# EAGLE design sonars (EAGLE 6.4)
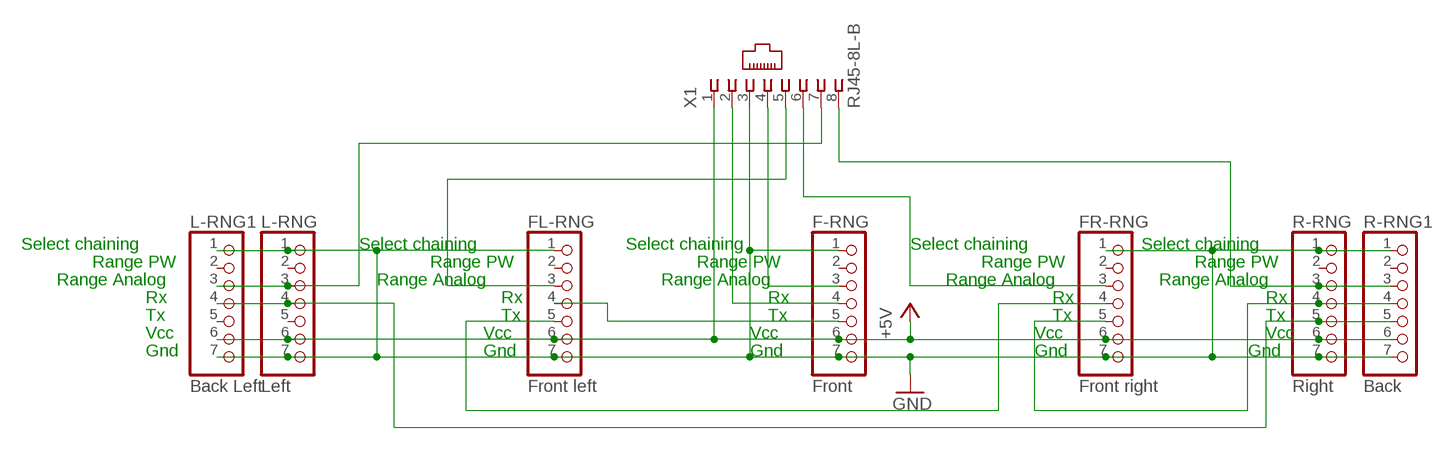
[diagram p0: schematic, sheet 1]

## Parts
F-RNG  Front  PINHD-1X7  [1X07]
FL-RNG  Front left  PINHD-1X7  [1X07]
FR-RNG  Front right  PINHD-1X7  [1X07]
L-RNG  Left  PINHD-1X7  [1X07]
L-RNG1  Back Left  PINHD-1X7  [1X07]
R-RNG  Right  PINHD-1X7  [1X07]
R-RNG1  Back  PINHD-1X7  [1X07]
X1  RJ45-8L-B  [RJ45-NO-SHIELD]

## Nets
+5V: F-RNG.6 FL-RNG.6 FR-RNG.6 L-RNG1.6 L-RNG.6 R-RNG1.6 R-RNG.6 X1.1
CHN: F-RNG.4 X1.2
F>FL: F-RNG.5 FL-RNG.4
F_RNG: F-RNG.3 X1.4
FL>FR: FL-RNG.5 FR-RNG.4
FL_RNG: FL-RNG.3 X1.5
FR>R: FR-RNG.5 R-RNG1.4 R-RNG.4
FR_RNG: FR-RNG.3 X1.6
GND: F-RNG.1 F-RNG.7 FL-RNG.1 FL-RNG.7 FR-RNG.1 FR-RNG.7 L-RNG1.1 L-RNG1.7 L-RNG.1 L-RNG.7 R-RNG1.1 R-RNG1.7 R-RNG.1 R-RNG.7 X1.3
L_RNG: L-RNG1.3 L-RNG.3 X1.7
R>L: L-RNG1.4 L-RNG.4 R-RNG1.5 R-RNG.5
R_RNG: R-RNG1.3 R-RNG.3 X1.8
Unconnected: F-RNG.2 FL-RNG.2 FR-RNG.2 L-RNG1.2 L-RNG1.5 L-RNG.2 L-RNG.5 R-RNG1.2 R-RNG.2

## Notes on the sheet
- Select chaining | Select chaining | Select chaining | Select chaining | Select chaining
- Range PW | Range PW | Range PW | Range PW | Range PW
- Range Analog | Range Analog | Range Analog | Range Analog | Range Analog
- Rx | Rx | Rx | Rx | Rx
- Tx | Tx | Tx | Tx | Tx
- Vcc | Vcc | Vcc | Vcc | Vcc
- Gnd | Gnd | Gnd | Gnd | Gnd

## Library data of the parts
F-RNG FL-RNG FR-RNG L-RNG L-RNG1 R-RNG R-RNG1 = pinhead:PINHD-1X7: PIN HEADER
X1 = con-tycoelectronics:RJ45: CORCOM Modular RJ Jacks No Shield Source: www.tycoelectronics.com .. ENG_DS_1654001_1099_RJ_L_0507.pdf; MF: TYCO ELECTRONICS; MPN: RJ45-8L-B; OC_FARNELL: 1279843; OC_NEWARK: 52K4445

## Board
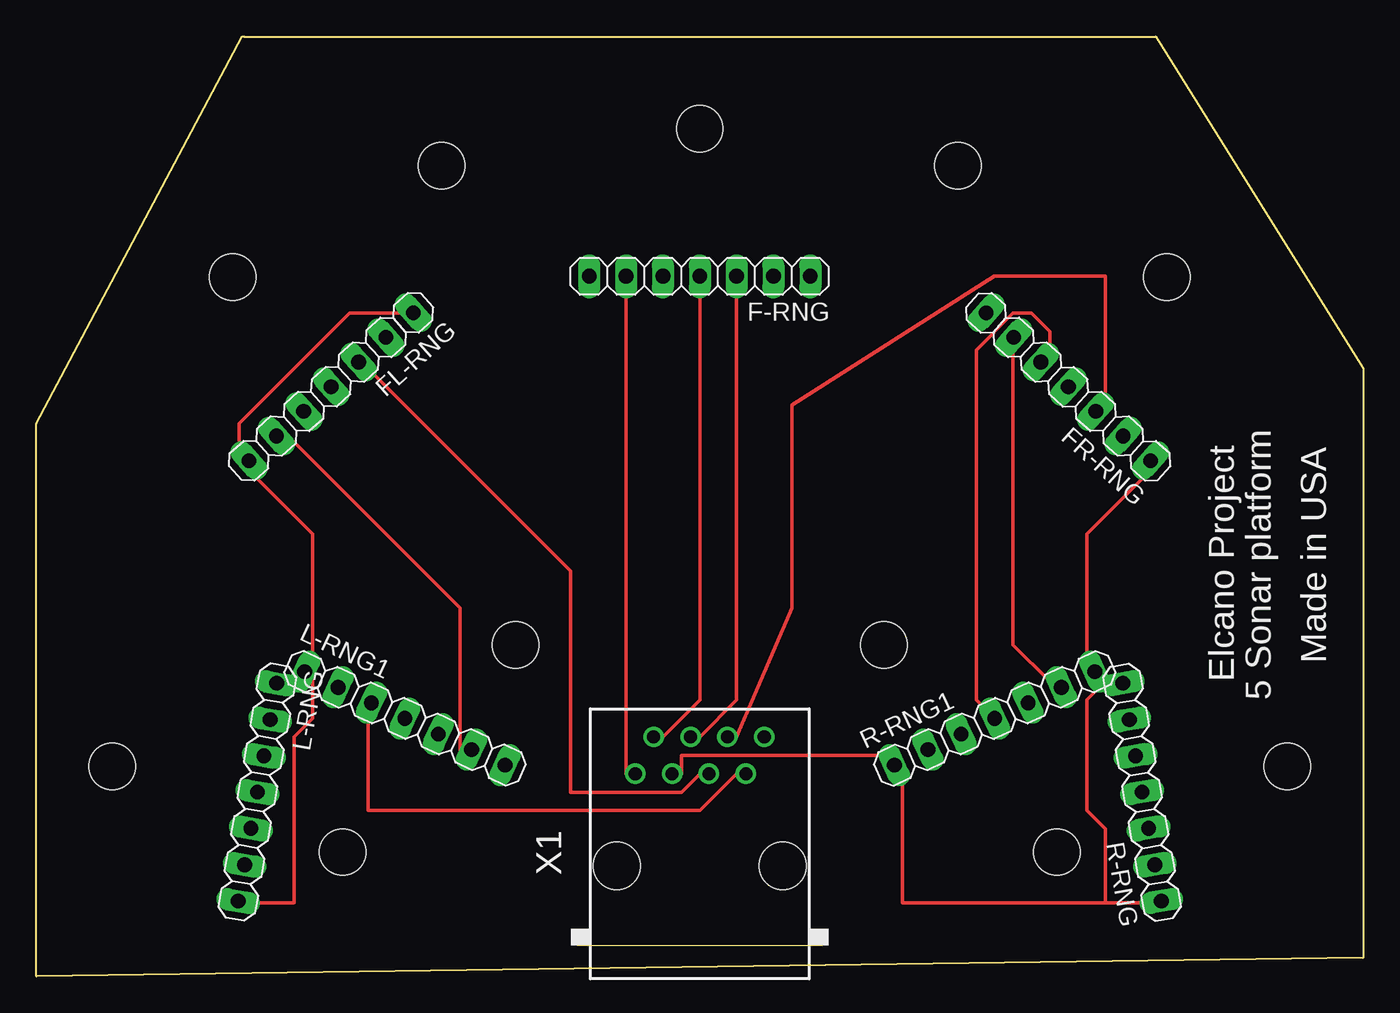
[diagram p1: board, top side]
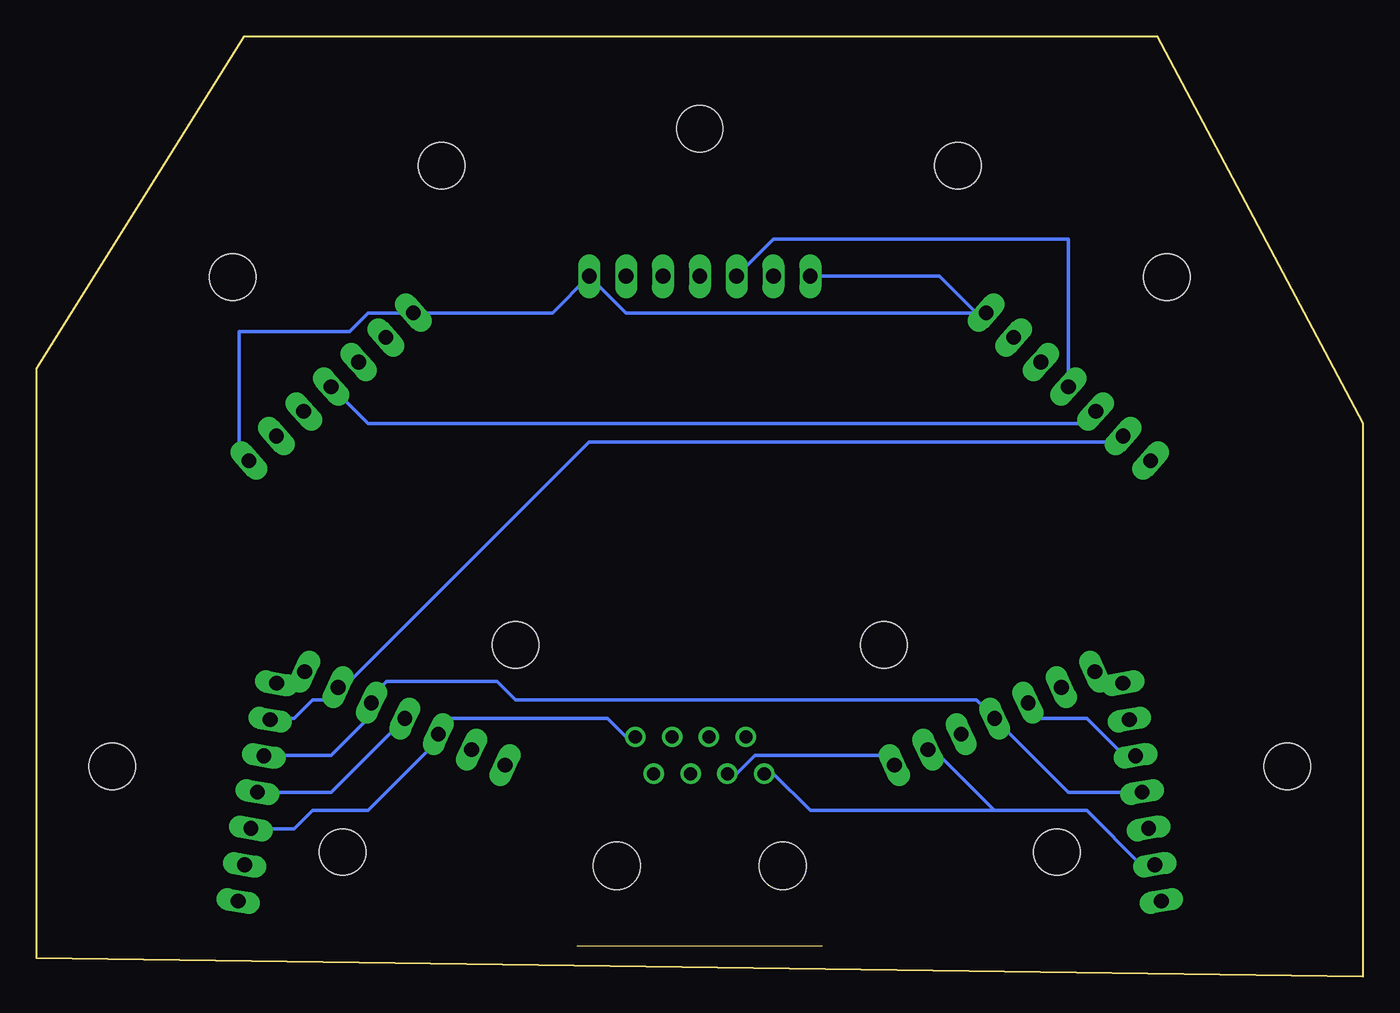
[diagram p2: board, bottom side, seen from below]

Size 91.44 x 64.8 mm. Coordinates in mm from the lower left corner, seen from the top.
Outline: 14.2,64.8 14.3,64.77 77.14,64.77 91.44,41.91 91.44,1.27 0,0 0,38.1 14.2,64.8
Copper layers (1*16): Top 0.035mm / dielectric 1.5mm / Bottom 0.035mm
Design rules "default": minimum track width 10mil, minimum drill 24mil, track to track 8mil, track to pad 8mil, pad to pad 8mil, via to via 8mil, smd to smd 8mil, copper to edge 40mil, drill to drill 8mil, minimum pad ring 10mil, minimum via ring 8mil, stop-mask expansion 4mil, vias tented up to drill 0mil, thermal gap 10mil
Holes 3.2 mm at 45.72,58.42 27.94,55.88 63.5,55.88 21.11,8.57 70.33,8.57 77.92,48.19 13.52,48.19 5.23,14.46 86.21,14.46 33.02,22.86 58.42,22.86

### Footprints (pad centres in the part's own frame; a part is rotated, then mirrored left to right if it is on the bottom)
1X07 = drill 1.016 long: 1 -7.62,0; 2 -5.08,0; 3 -2.54,0; 4 0,0; 5 2.54,0; 6 5.08,0; 7 7.62,0
RJ45-NO-SHIELD = drill 0.9 pad 1.4: 1 -4.445,6.35; 2 -3.175,8.89; 3 -1.905,6.35; 4 -0.635,8.89; 5 0.635,6.35; 6 1.905,8.89; 7 3.175,6.35; 8 4.445,8.89 | hole 3.251: -5.715,0; 5.715,0

### Placement (x,y rotation side)
F-RNG  45.72,48.26 180 top
FL-RNG  20.32,40.64 222 top
FR-RNG  71.12,40.64 138 top
L-RNG  15.24,12.7 260 top
L-RNG1  Back Left  [1X07]  25.4,17.78 335 top
R-RNG  76.2,12.7 100 top
R-RNG1  Back Right  [1X07]  66.04,17.78 25 top
X1  45.72,7.62 0 top

### Tracks (layer width: path | path; a pad name or v marks a point on that pad's centre or on a via)
+5V
  Top 0.254: F-RNG.6 40.64,13.97 X1.1 | FR-RNG.6 67.31,43.18 67.31,22.86 69.85,20.32 R-RNG1.6 | FL-RNG.6 17.78,36.83 29.21,25.4 29.21,15.24 L-RNG1.6
  Bottom 0.254: R-RNG.6 74.93,17.78 73.66,17.78 72.39,19.05 71.12,19.05 R-RNG1.6 69.85,20.32 53.34,36.83 17.78,36.83 FL-RNG.6 | 25.4,11.43 19.05,11.43 15.24,7.62 L-RNG.6 | 25.4,11.43 29.21,15.24 L-RNG1.6 | 25.4,11.43 38.1,11.43 40.64,13.97 X1.1
CHN
  Top 0.254: F-RNG.4 45.72,19.05 43.18,16.51 X1.2
F>FL
  Bottom 0.254: FL-RNG.4 20.32,50.8 40.64,50.8 F-RNG.5
F_RNG
  Top 0.254: F-RNG.3 48.26,19.05 45.72,16.51 X1.4
FL>FR
  Bottom 0.254: FR-RNG.4 68.58,38.1 19.05,38.1 FL-RNG.5
FL_RNG
  Top 0.254: X1.5 45.72,13.97 44.45,12.7 36.83,12.7 36.83,27.94 22.86,41.91 FL-RNG.3
FR>R
  Top 0.254: R-RNG1.4 64.77,19.05 64.77,43.18 67.31,45.72 68.58,45.72 69.85,44.45 69.85,43.18 FR-RNG.5
  Bottom 0.254: R-RNG1.4 71.12,12.7 R-RNG.4
FR_RNG
  Top 0.254: X1.6 48.26,16.51 52.07,25.4 52.07,39.37 66.04,48.26 73.66,48.26 73.66,39.37 FR-RNG.3
GND
  Top 0.254: 73.66,20.32 R-RNG.7 | FR-RNG.1 76.2,34.29 72.39,30.48 72.39,21.59 R-RNG1.7 73.66,20.32 | X1.3 44.45,13.97 44.45,15.24 58.42,15.24 R-RNG1.1 59.69,13.97 59.69,5.08 73.66,5.08 | 73.66,5.08 77.47,5.08 R-RNG.1 | 73.66,20.32 72.39,19.05 72.39,11.43 73.66,10.16 73.66,5.08 | 19.05,21.59 19.05,17.78 17.78,16.51 17.78,5.08 13.97,5.08 L-RNG.7 | L-RNG.1 17.78,20.32 L-RNG1.1 19.05,21.59 | 19.05,21.59 19.05,30.48 15.24,34.29 FL-RNG.7 13.97,35.56 13.97,38.1 21.59,45.72 25.4,45.72 FL-RNG.1
  Bottom 0.254: X1.3 43.18,13.97 41.91,15.24 33.02,15.24 L-RNG1.7 | 26.67,45.72 29.21,48.26 F-RNG.7 | 26.67,45.72 50.8,45.72 F-RNG.1 55.88,45.72 64.77,45.72 FR-RNG.7 66.04,45.72 68.58,45.72 69.85,44.45 77.47,44.45 77.47,35.56 FR-RNG.1 | 26.67,45.72 FL-RNG.1
L_RNG
  Top 0.254: X1.7 48.26,13.97 45.72,11.43 22.86,11.43 22.86,17.78 L-RNG1.3
  Bottom 0.254: L-RNG.3 16.51,15.24 19.05,17.78 22.86,17.78 L-RNG1.3
R>L
  Bottom 0.254: R-RNG.5 74.93,15.24 71.12,15.24 68.58,17.78 R-RNG1.5 68.58,19.05 67.31,20.32 59.69,20.32 58.42,19.05 26.67,19.05 L-RNG1.4 20.32,12.7 L-RNG.4
R_RNG
  Bottom 0.254: X1.8 50.8,16.51 52.07,17.78 63.5,17.78 R-RNG1.3 63.5,16.51 68.58,11.43 72.39,11.43 73.66,10.16 76.2,10.16 R-RNG.3

### Text on the board
tNames: Made in USA | Elcano Project | 5 Sonar platform